# EasyEDA schematic EasyEDA Schematic .json
TITLE: STM32 Flight Computer; REV: 1.0; Date: 2025-10-28; Sheet: 1/1; Drawn By: usedgenes; Company: Your Company
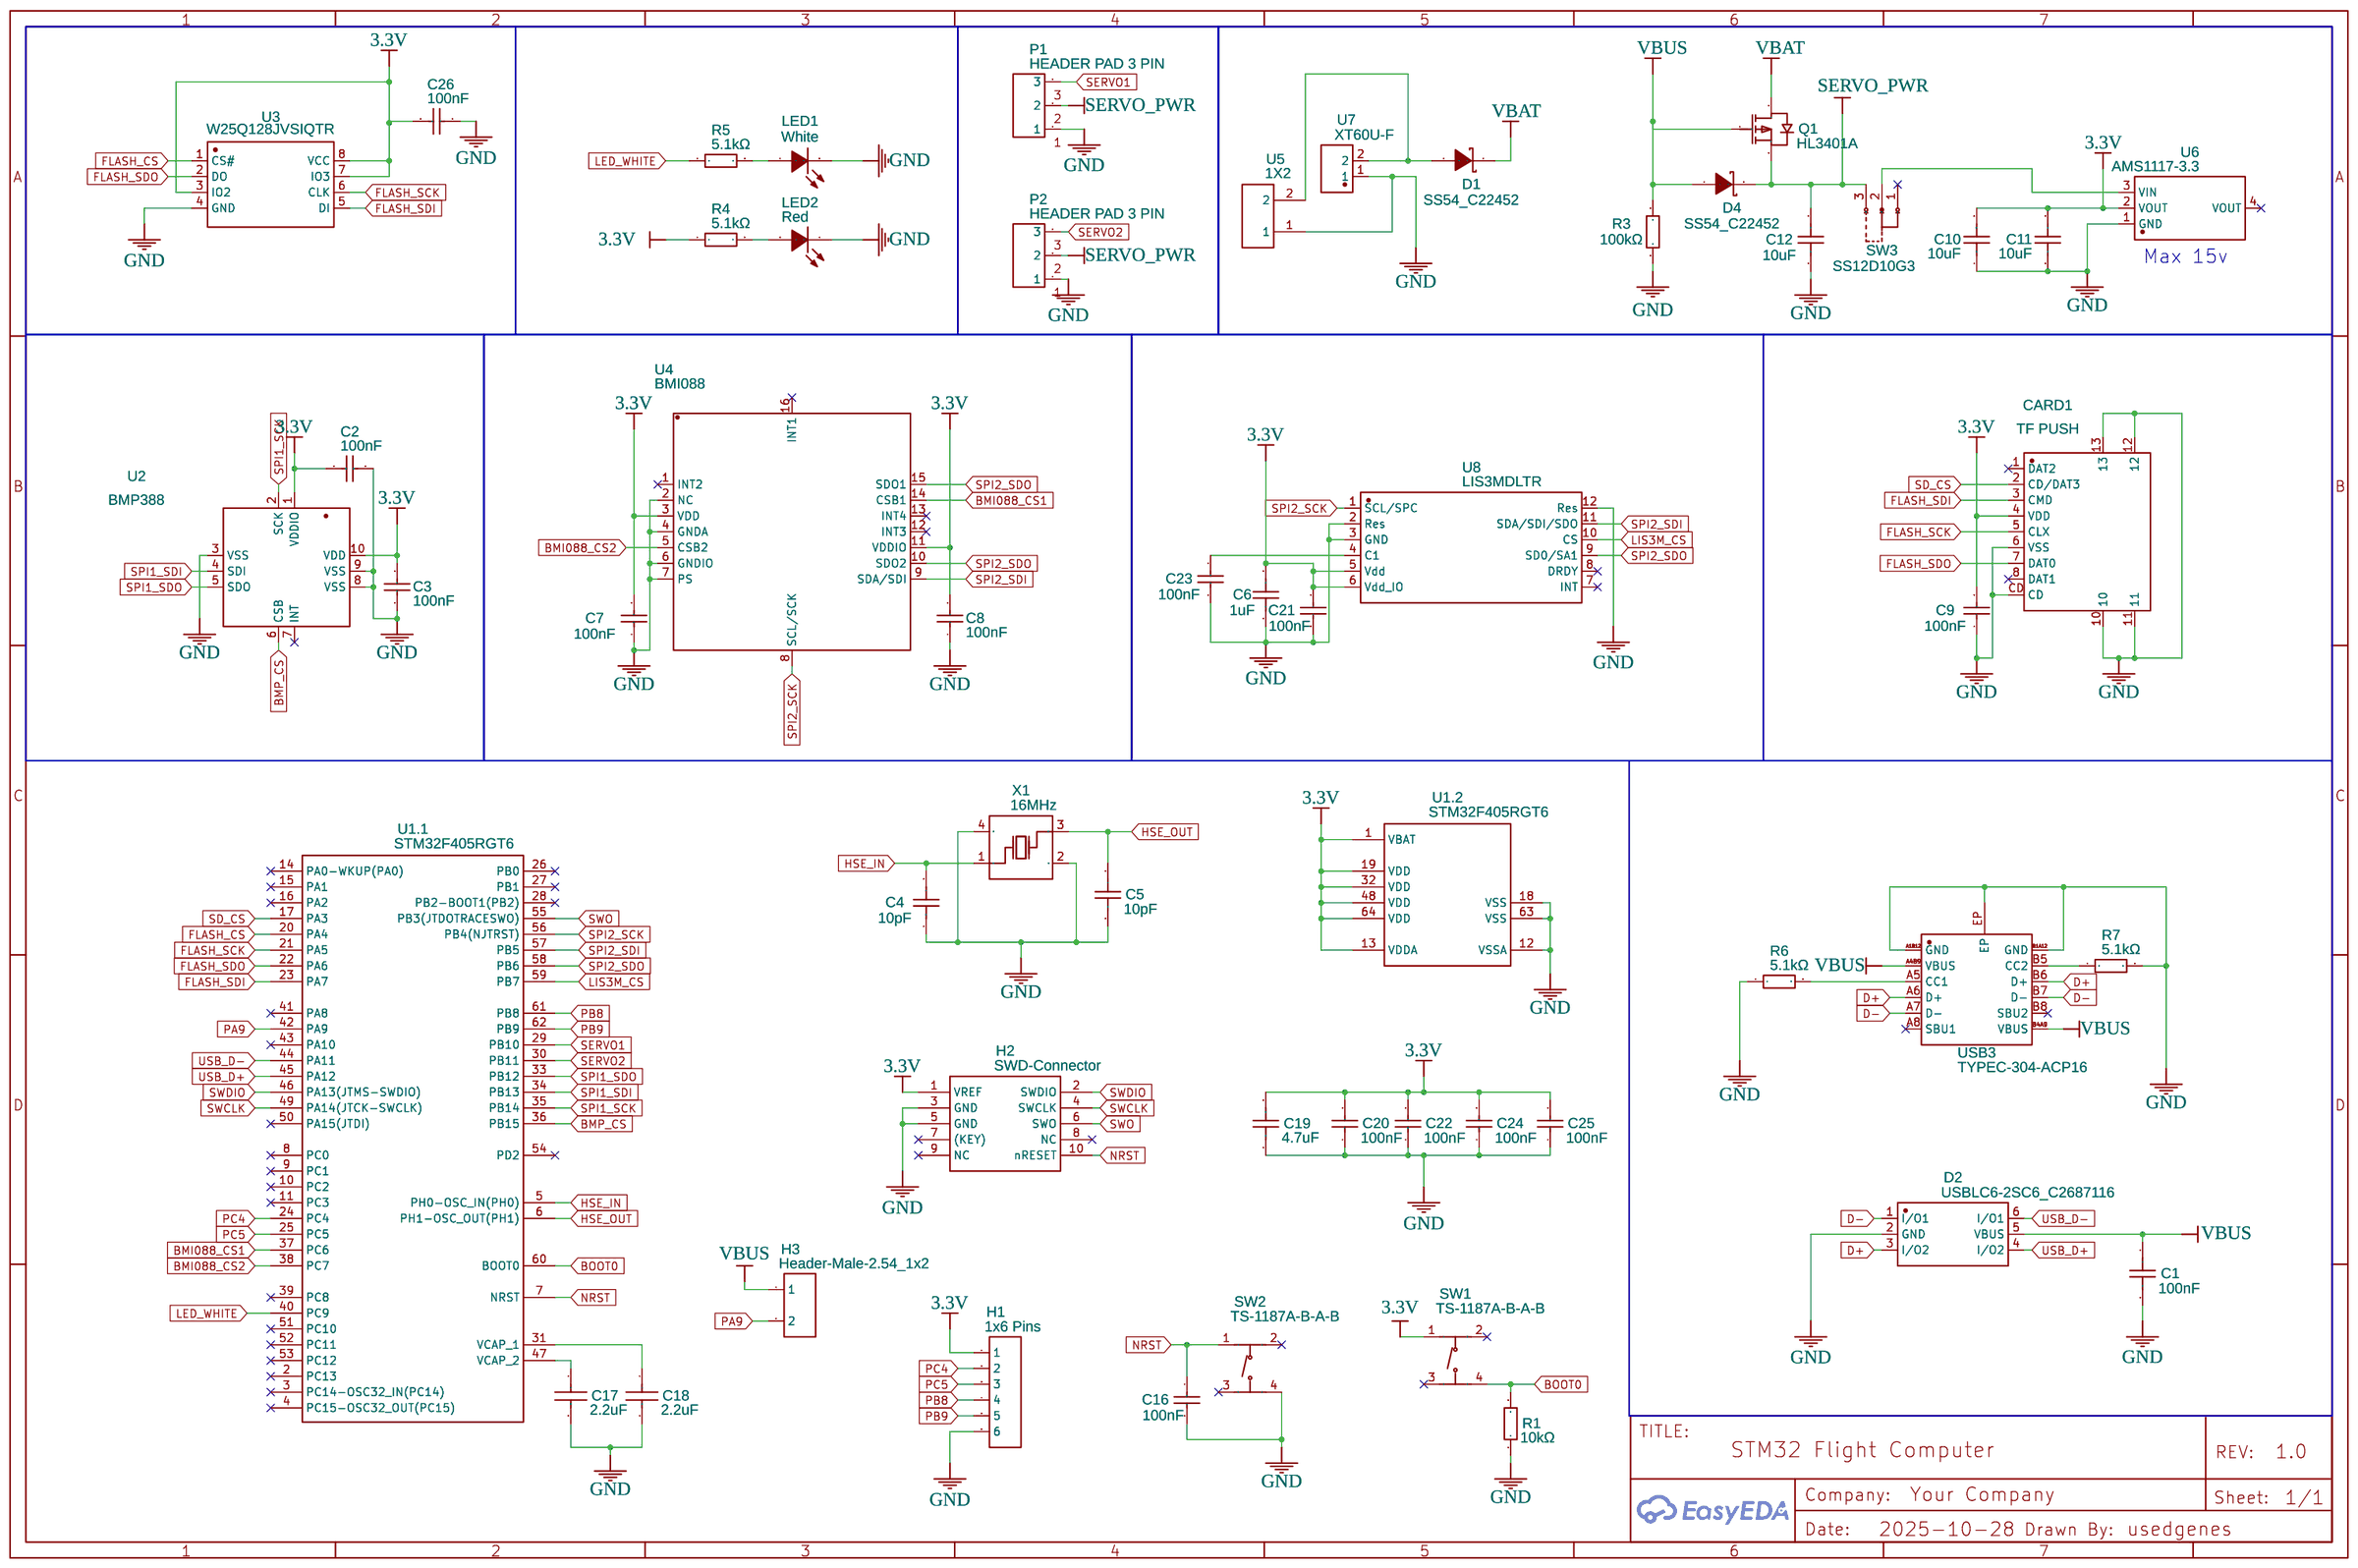
[diagram p0: schematic sheet]

## Parts
C1  100nF  [C0402]
C2  100nF  [C0402]
C3  100nF  [C0402]
C4  10pF  [C0402]
C5  10pF  [C0402]
C6  1uF  [C0402]
C7  100nF  [C0402]
C8  100nF  [C0402]
C9  100nF  [C0402]
C10  10uF  [C0603]
C11  10uF  [C0603]
C12  10uF  [C0603]
C16  100nF  [C0402]
C17  2.2uF  [C0402]
C18  2.2uF  [C0402]
C19  4.7uF  [C0402]
C20  100nF  [C0402]
C21  100nF  [C0402]
C22  100nF  [C0402]
C23  100nF  [C0402]
C24  100nF  [C0402]
C25  100nF  [C0402]
C26  100nF  [C0402]
CARD1  TF PUSH  [TF-SMD_TF-PUSH]
D1  SS54_C22452  [SMA_L4.4-W2.8-LS5.4-R-RD]
D2  USBLC6-2SC6_C2687116  [SOT-23-6_L2.9-W1.6-P0.95-LS2.8-BL]
D4  SS54_C22452  [SMA_L4.4-W2.8-LS5.4-R-RD]
H1  1x6 Pins  [HEADER_PINS_1X6_2.54MM]
H2  SWD-Connector  [SWD-CONNECTOR]
H3  Header-Male-2.54_1x2  [HDR-TH_2P-P2.54-V-M-1]
LED1  White  [LED0603-R-RD_WHITE]
LED2  Red  [LED0603-RD]
P1  HEADER PAD 3 PIN  [CONNECTOR_PINHEADER_2.54MM:PINHEADER_1X3]
P2  HEADER PAD 3 PIN  [CONNECTOR_PINHEADER_2.54MM:PINHEADER_1X3]
Q1  HL3401A  [SOT-23-3_L2.9-W1.3-P1.90-LS2.4-BR]
R1  10kΩ  [R0402]
R3  100kΩ  [R0603]
R4  5.1kΩ  [R0402]
R5  5.1kΩ  [R0402]
R6  5.1kΩ  [R0402]
R7  5.1kΩ  [R0402]
SW1  TS-1187A-B-A-B  [SW-SMD_4P-L5.1-W5.1-P3.70-LS6.5-TL_H1.5]
SW2  TS-1187A-B-A-B  [SW-SMD_4P-L5.1-W5.1-P3.70-LS6.5-TL_H1.5]
SW3  SS12D10G3  [SW-TH_3P-P4.8-L12.7-W6.7_SS12D10G3]
U1  STM32F405RGT6  [LQFP-64_L10.0-W10.0-P0.50-LS12.0-BL]  (sections 1,2)
U2  BMP388  [SENSORM-SMD_BMP388]
U3  W25Q128JVSIQTR  [SOIC-8_L5.3-W5.3-P1.27-LS8.0-BL]
U4  BMI088  [LGA-16_L4.5-W3.0-P0.50-BL]
U5  1X2  [PIN HEADER CONNECTOR 1X2 PINS_PITCH 2.54MM]
U6  AMS1117-3.3  [SOT-223-3_L6.5-W3.4-P2.30-LS7.0-BR]
U7  XT60U-F  [CONN-TH_XT60U-F]
U8  LIS3MDLTR  [LGA-12_L2.0-W2.0-P0.50-BL]
USB3  TYPEC-304-ACP16  [USB-C-SMD_TYPE-C-16P-1]
X1  16MHz  [OSC-SMD_4P-L3.2-W2.5-BL]

## Library data of the parts
C1-C3 C7-C9 C16 C20-C26 = CL05B104KO5NNNC: Supplier: LCSC; Manufacturer: SAMSUNG(三星); Supplier Part: C1525; JLCPCB Part Class: Basic Part
C4 C5 = CL05C100JB5NNNC: Supplier: LCSC; Manufacturer: SAMSUNG(三星); Supplier Part: C32949; JLCPCB Part Class: Basic Part
C6 = CL05A105KA5NQNC: Supplier: LCSC; Manufacturer: SAMSUNG(三星); Supplier Part: C52923; JLCPCB Part Class: Basic Part
C10-C12 = CL10A106KP8NNNC: Supplier: LCSC; Manufacturer: SAMSUNG(三星); Supplier Part: C19702; JLCPCB Part Class: Basic Part
C17 C18 = CL05A225MQ5NSNC: Supplier: LCSC; Manufacturer: SAMSUNG(三星); Supplier Part: C12530; JLCPCB Part Class: Basic Part
C19 = CL05A475MP5NRNC: Supplier: LCSC; Manufacturer: SAMSUNG(三星); Supplier Part: C23733; JLCPCB Part Class: Basic Part
CARD1 = TF PUSH: Contributor: LCSC; Supplier: LCSC; Supplier Part: C393941; Manufacturer: SHOU HAN(首韩); JLCPCB Part Class: Extended Part
D1 D4 = SS54_C22452: Supplier: LCSC; Manufacturer Part: SS54; Manufacturer: MDD(辰达半导体); Supplier Part: C22452; JLCPCB Part Class: Basic Part
D2 = USBLC6-2SC6_C2687116: Contributor: LCSC; Supplier: LCSC; Supplier Part: C2687116; Manufacturer: UMW(友台半导体); Manufacturer Part: USBLC6-2SC6; JLCPCB Part Class: Extended Part
H1 = HEADER_PINS_1X6_2.54MM: Contributor: vblucifer
H2 = SWD-Connector: Contributor: on4ill
H3 = Header-Male-2.54_1x2: Supplier: LCSC; Manufacturer: TE Connectivity(泰科电子); Manufacturer Part: 826629-2; Supplier Part: C86471; JLCPCB Part Class: Extended Part
LED1 = 0603White light_C2290: Supplier: LCSC; Manufacturer: KENTO; Manufacturer Part: KT-0603白灯; Supplier Part: C2290; JLCPCB Part Class: Basic Part
LED2 = KT-0603R: Supplier: LCSC; Manufacturer: KENTO; Supplier Part: C2286; JLCPCB Part Class: Basic Part
P1 P2 = HEADER PAD 3 PIN: Supplier: LCSC; Manufacturer: BOOMELE; Manufacturer Part: Female headerHDR1X8-2.54; Supplier Part: C27438; JLCPCB Part Class: Extended Part; Contributor: juchani
Q1 = HL3401A: Supplier: LCSC; Supplier Part: C7420349; Manufacturer: R+O(宏嘉诚); Contributor: lcsc; JLCPCB Part Class: Extended Part
R1 = 0402WGF1002TCE: Supplier: LCSC; Manufacturer: UNI-ROYAL(厚声); Supplier Part: C25744; JLCPCB Part Class: Basic Part
R3 = 0603WAF1003T5E: Supplier: LCSC; Manufacturer: UNI-ROYAL(厚声); Supplier Part: C25803; JLCPCB Part Class: Basic Part
R4-R7 = 0402WGF5101TCE: Supplier: LCSC; Manufacturer: UNI-ROYAL(厚声); Supplier Part: C25905; JLCPCB Part Class: Basic Part
SW1 SW2 = TS-1187A-B-A-B: Contributor: LCSC; Supplier: LCSC; Supplier Part: C318884; Manufacturer: XKB Connection(中国星坤); JLCPCB Part Class: Basic Part
SW3 = SS12D10G3: Supplier: LCSC; Supplier Part: C7431053; Manufacturer: SHOU HAN(首韩); Contributor: lcsc
U1 = STM32F405RGT6: tags: STM32; subpart_no: 1; image: http://image.lceda.cn/szlcsc/C15742.jpg; Supplier Part: C15742; Supplier: LCSC; Manufacturer: ST(意法半导体); JLCPCB Part Class: Extended Part
U2 = BMP388: Contributor: LCSC; Supplier: LCSC; Supplier Part: C779278; Manufacturer: Bosch(博世); JLCPCB Part Class: Extended Part
U3 = W25Q128JVSIQTR: Supplier: LCSC; Manufacturer: Winbond(华邦); Manufacturer Part: W25Q128JVSIQ; Supplier Part: C97521; JLCPCB Part Class: Basic Part
U4 = BMI088: Contributor: LCSC; Supplier: LCSC; Supplier Part: C194919; Manufacturer: Bosch(博世); JLCPCB Part Class: Extended Part
U5 = 1X2: Contributor: Ramsha
U6 = AMS1117-3.3: sourceId: dwIGgezVh; Supplier: LCSC; Manufacturer: AMS; Supplier Part: C6186; JLCPCB Part Class: Basic Part
U7 = XT60U-F: Supplier: LCSC; Supplier Part: C19191801; Manufacturer: AMASS(艾迈斯); JLCPCB Part Class: Extended Part; Contributor: lcsc
U8 = LIS3MDLTR: Contributor: LCSC; Supplier: LCSC; Supplier Part: C478483; Manufacturer: ST(意法半导体); JLCPCB Part Class: Extended Part
USB3 = TYPEC-304-ACP16: Contributor: LCSC; Supplier: LCSC; Supplier Part: C2982555; Manufacturer: XUNPU(讯普); JLCPCB Part Class: Extended Part
X1 = X322516MLB4SI: Supplier: LCSC; Manufacturer: YXC(扬兴晶振); Supplier Part: C13738; JLCPCB Part Class: Basic Part

## Nets
3.3V: C2.2 C3.2 C6.2 C7.2 C8.2 C9.2 C10.2 C11.2 C19.2 C20.2 C21.1 C22.2 C24.2 C25.2 C26.2 CARD1.4(VDD) H1.1 H2.1(VREF) R4.1 SW1.1(A) U1.1(VBAT) U1.13(VDDA) U1.19(VDD) U1.32(VDD) U1.48(VDD) U1.64(VDD) U2.1(VDDIO) U2.10(VDD) U3.3(IO2) U3.7(IO3) U3.8(VCC) U4.3(VDD) U4.11(VDDIO) U6.2(VOUT) U8.5(Vdd) U8.6(Vdd_IO)
GND: C1.2 C2.1 C3.1 C4.1 C5.1 C6.1 C7.1 C8.1 C9.1 C10.1 C11.1 C12.1 C16.2 C17.2 C18.2 C19.1 C20.1 C21.2 C22.1 C23.2 C24.1 C25.1 C26.1 CARD1.6(VSS) CARD1.10 CARD1.11 CARD1.12 CARD1.13 CARD1.CD D2.2(GND) H1.6 H2.3(GND) H2.5(GND) LED1.2(K) LED2.1(K) P1.1 P2.1 R1.1 R3.1 R6.1 R7.2 SW2.4(D) U1.12(VSSA) U1.18(VSS) U1.63(VSS) U2.3(VSS) U2.8(VSS) U2.9(VSS) U3.4(GND) U4.2(NC) U4.4(GNDA) U4.6(GNDIO) U4.7(PS) U5.1 U6.1(GND) U7.1 U8.2(Res) U8.3(GND) U8.12(Res) USB3.A1B12(GND) USB3.B1A12(GND) USB3.EP X1.2(GND) X1.4(GND)
VBAT: D1.2(K) Q1.3(D)
VBUS: C1.1 D2.5(VBUS) D4.1(A) H3.1 Q1.1(G) R3.2 USB3.A4B9(VBUS) USB3.B4A9(VBUS)
BMI088_CS1: U1.37(PC6) U4.14(CSB1)
BMI088_CS2: U1.38(PC7) U4.5(CSB2)
BMP_CS: U1.36(PB15) U2.6(CSB)
BOOT0: R1.2 SW1.4(D) U1.60(BOOT0)
D+: D2.3(I/O2) USB3.A6(D+) USB3.B6(D+)
D-: D2.1(I/O1) USB3.A7(D-) USB3.B7(D-)
FLASH_CS: U1.20(PA4) U3.1(CS#)
FLASH_SCK: CARD1.5(CLX) U1.21(PA5) U3.6(CLK)
FLASH_SDI: CARD1.3(CMD) U1.23(PA7) U3.5(DI)
FLASH_SDO: CARD1.7(DAT0) U1.22(PA6) U3.2(DO)
HSE_IN: C4.2 U1.5(PH0-OSC_IN(PH0)) X1.1(OSC1)
HSE_OUT: C5.2 U1.6(PH1-OSC_OUT(PH1)) X1.3(OSC2)
LED_WHITE: R5.1 U1.40(PC9)
LIS3M_CS: U1.59(PB7) U8.10(CS)
NRST: C16.1 H2.10(nRESET) SW2.1(A) U1.7(NRST)
PA9: H3.2 U1.42(PA9)
PB8: H1.4 U1.61(PB8)
PB9: H1.5 U1.62(PB9)
PC4: H1.2 U1.24(PC4)
PC5: H1.3 U1.25(PC5)
SD_CS: CARD1.2(CD/DAT3) U1.17(PA3)
SERVO1: P1.3 U1.29(PB10)
SERVO2: P2.3 U1.30(PB11)
SERVO_PWR: C12.2 D4.2(K) P1.2 P2.2 Q1.2(S) SW3.3
SPI1_SCK: U1.35(PB14) U2.2(SCK)
SPI1_SDI: U1.34(PB13) U2.4(SDI)
SPI1_SDO: U1.33(PB12) U2.5(SDO)
SPI2_SCK: U1.56(PB4(NJTRST)) U4.8(SCL/SCK) U8.1(SCL/SPC)
SPI2_SDI: U1.57(PB5) U4.9(SDA/SDI) U8.11(SDA/SDI/SDO)
SPI2_SDO: U1.58(PB6) U4.10(SDO2) U4.15(SDO1) U8.9(SD0/SA1)
SWCLK: H2.4(SWCLK) U1.49(PA14(JTCK-SWCLK))
SWDIO: H2.2(SWDIO) U1.46(PA13(JTMS-SWDIO))
SWO: H2.6(SWO) U1.55(PB3(JTDOTRACESWO))
USB_D+: D2.4(I/O2) U1.45(PA12)
USB_D-: D2.6(I/O1) U1.44(PA11)
Net-(C17-1): C17.1 U1.47(VCAP_2)
Net-(C18-1): C18.1 U1.31(VCAP_1)
Net-(C23-1): C23.1 U8.4(C1)
Net-(D1-1): D1.1(A) U5.2 U7.2
Net-(LED1-1): LED1.1(A) R5.2
Net-(LED2-2): LED2.2(A) R4.2
Net-(R6-2): R6.2 USB3.A5(CC1)
Net-(R7-1): R7.1 USB3.B5(CC2)
Net-(SW3-2): SW3.2 U6.3(VIN)

Not connected (* = marked no-connect by the designer): CARD1 1(DAT2)* 8(DAT1)*; H2 7((KEY))* 8(NC)* 9(NC)*; SW1 2(B)* 3(C)*; SW2 2(B)* 3(C)*; SW3 1*; U1 2(PC13)* 3(PC14-OSC32_IN(PC14))* 4(PC15-OSC32_OUT(PC15))* 8(PC0)* 9(PC1)* 10(PC2)* 11(PC3)* 14(PA0-WKUP(PA0))* 15(PA1)* 16(PA2)* 26(PB0)* 27(PB1)* 28(PB2-BOOT1(PB2))* 39(PC8)* 41(PA8)* 43(PA10)* 50(PA15(JTDI))* 51(PC10)* 52(PC11)* 53(PC12)* 54(PD2)*; U2 7(INT)*; U4 1(INT2)* 12(INT3)* 13(INT4)* 16(INT1)*; U6 4(VOUT)*; U8 7(INT)* 8(DRDY)*; USB3 A8(SBU1)* B8(SBU2)*

## Notes on the sheet
- Max 15v
